# Altium schematic sheet memory.SCHDOC: Backplane
size B; Engineer: Eric Jonas; Organization: Wilson Lab; Address1: Picower Institute, MIT; Address2: 43 Vassar St. 46-5227; Address3: Cambridge, MA 02139; Address4: Australia 2086
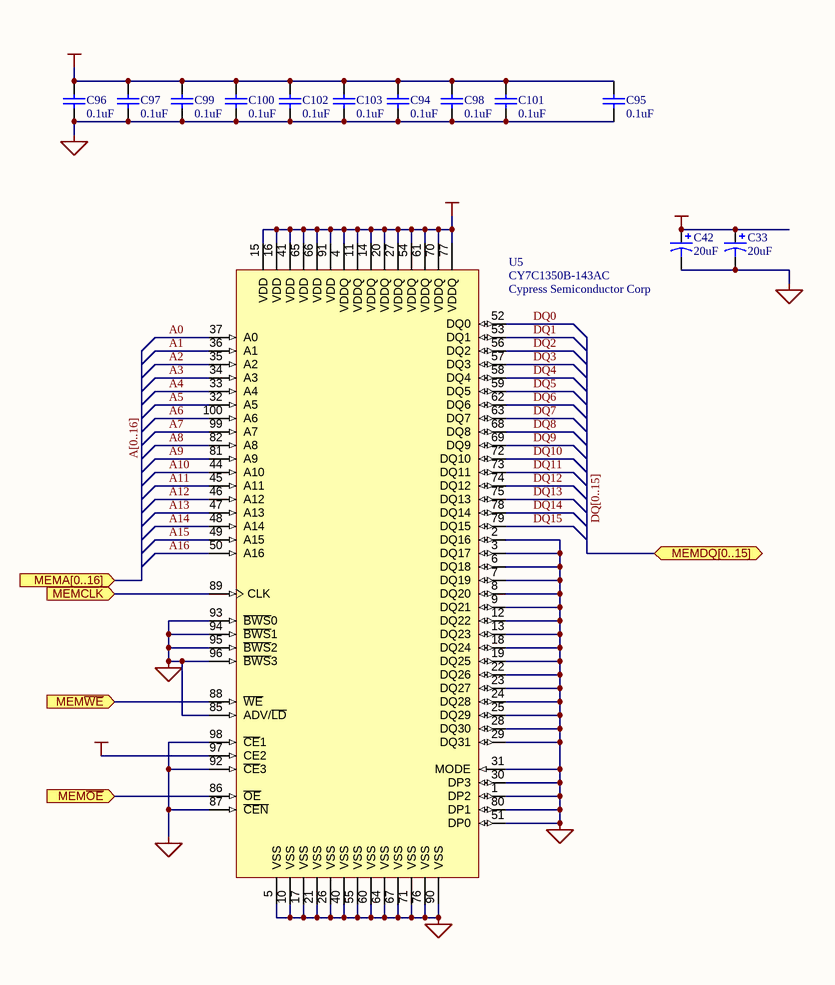
[diagram p0: memory.SCHDOC]

## Parts
C33  value 20uF  [C]  (hidden comment: Cap Pol1)
C42  value 20uF  [C]  (hidden comment: Cap Pol1)
C94  value 0.1uF  [CC1005-0402]  (hidden comment: Cap)
C95  value 0.1uF  [CC1005-0402]  (hidden comment: Cap)
C96  value 0.1uF  [CC1005-0402]  (hidden comment: Cap)
C97  value 0.1uF  [CC1005-0402]  (hidden comment: Cap)
C98  value 0.1uF  [CC1005-0402]  (hidden comment: Cap)
C99  value 0.1uF  [CC1005-0402]  (hidden comment: Cap)
C100  value 0.1uF  [CC1005-0402]  (hidden comment: Cap)
C101  value 0.1uF  [CC1005-0402]  (hidden comment: Cap)
C102  value 0.1uF  [CC1005-0402]  (hidden comment: Cap)
C103  value 0.1uF  [CC1005-0402]  (hidden comment: Cap)
U5  CY7C1350B-143AC  Vendor: Cypress Semiconductor Corp  [R-QFP14x20-G100/N]

## Ports
MEMA[0..16] (in), MEMCLK (in), MEMDQ[0..15] (bidir), MEM~{OE} (in), MEM~{WE} (in)

## Nets
GND: C33.2 C42.2 C94.1 C95.1 C96.1 C97.1 C98.1 C99.1 C100.1 C101.1 C102.1 C103.1 U5.1(DP2) U5.2(DQ16) U5.3(DQ17) U5.5(VSS) U5.6(DQ18) U5.7(DQ19) U5.8(DQ20) U5.9(DQ21) U5.10(VSS) U5.12(DQ22) U5.13(DQ23) U5.17(VSS) U5.18(DQ24) U5.19(DQ25) U5.21(VSS) U5.22(DQ26) U5.23(DQ27) U5.24(DQ28) U5.25(DQ29) U5.26(VSS) U5.28(DQ30) U5.29(DQ31) U5.30(DP3) U5.31(MODE) U5.40(VSS) U5.51(DP0) U5.55(VSS) U5.60(VSS) U5.64(VSS) U5.67(VSS) U5.71(VSS) U5.76(VSS) U5.80(DP1) U5.85(ADV/~{LD}) U5.87(~{CEN}) U5.90(VSS) U5.92(~{CE}3) U5.93(~{BWS}0) U5.94(~{BWS}1) U5.95(~{BWS}2) U5.96(~{BWS}3) U5.98(~{CE}1)
VCC: C33.1 C42.1 C94.2 C95.2 C96.2 C97.2 C98.2 C99.2 C100.2 C101.2 C102.2 C103.2 U5.4(VDDQ) U5.11(VDDQ) U5.14(VDDQ) U5.15(VDD) U5.16(VDD) U5.20(VDDQ) U5.27(VDDQ) U5.41(VDD) U5.54(VDDQ) U5.61(VDDQ) U5.65(VDD) U5.66(VDD) U5.70(VDDQ) U5.77(VDDQ) U5.91(VDD) U5.97(CE2)
A0: U5.37(A0)
A1: U5.36(A1)
A2: U5.35(A2)
A3: U5.34(A3)
A4: U5.33(A4)
A5: U5.32(A5)
A6: U5.100(A6)
A7: U5.99(A7)
A8: U5.82(A8)
A9: U5.81(A9)
A10: U5.44(A10)
A11: U5.45(A11)
A12: U5.46(A12)
A13: U5.47(A13)
A14: U5.48(A14)
A15: U5.49(A15)
A16: U5.50(A16)
DQ0: U5.52(DQ0)
DQ1: U5.53(DQ1)
DQ2: U5.56(DQ2)
DQ3: U5.57(DQ3)
DQ4: U5.58(DQ4)
DQ5: U5.59(DQ5)
DQ6: U5.62(DQ6)
DQ7: U5.63(DQ7)
DQ8: U5.68(DQ8)
DQ9: U5.69(DQ9)
DQ10: U5.72(DQ10)
DQ11: U5.73(DQ11)
DQ12: U5.74(DQ12)
DQ13: U5.75(DQ13)
DQ14: U5.78(DQ14)
DQ15: U5.79(DQ15)
MEMCLK: U5.89(CLK) ; port MEMCLK
MEM~{OE}: U5.86(~{OE}) ; port MEM~{OE}
MEM~{WE}: U5.88(~{WE}) ; port MEM~{WE}

## Buses and harness runs
bus A[0..16] = port MEMA[0..16]
bus DQ[0..15] = port MEMDQ[0..15]

## Notes on the sheet
- Title:
- Engineer:
- Date:
- Revision:
- Sheet
- of
- File:

## Library data of the parts
C33 C42 = Cap Pol1: Polarized Capacitor (Radial); Published: 8-Jun-2000; LatestRevisionDate: 17-Jul-2002; LatestRevisionNote: Re-released for DXP Platform.; Publisher: Altium Limited
C94-C103 = Cap: Capacitor; Manufacturer: Generic Components; Class I: Passive; Published: 8-Jun-2000; Revision: July-2002: Re-released for DXP Platform.; Publisher: Altium Limited; Class II: Capacitor
U5 = CY7C1350B: NoBL Pipelined SRAM 128kx36